# Altium schematic sheet Э3_7.SchDoc
size 420 x 297 mm; SheetNumber: 7; Scale: 1:1; DocumentType: Схема электрическая принципиальная
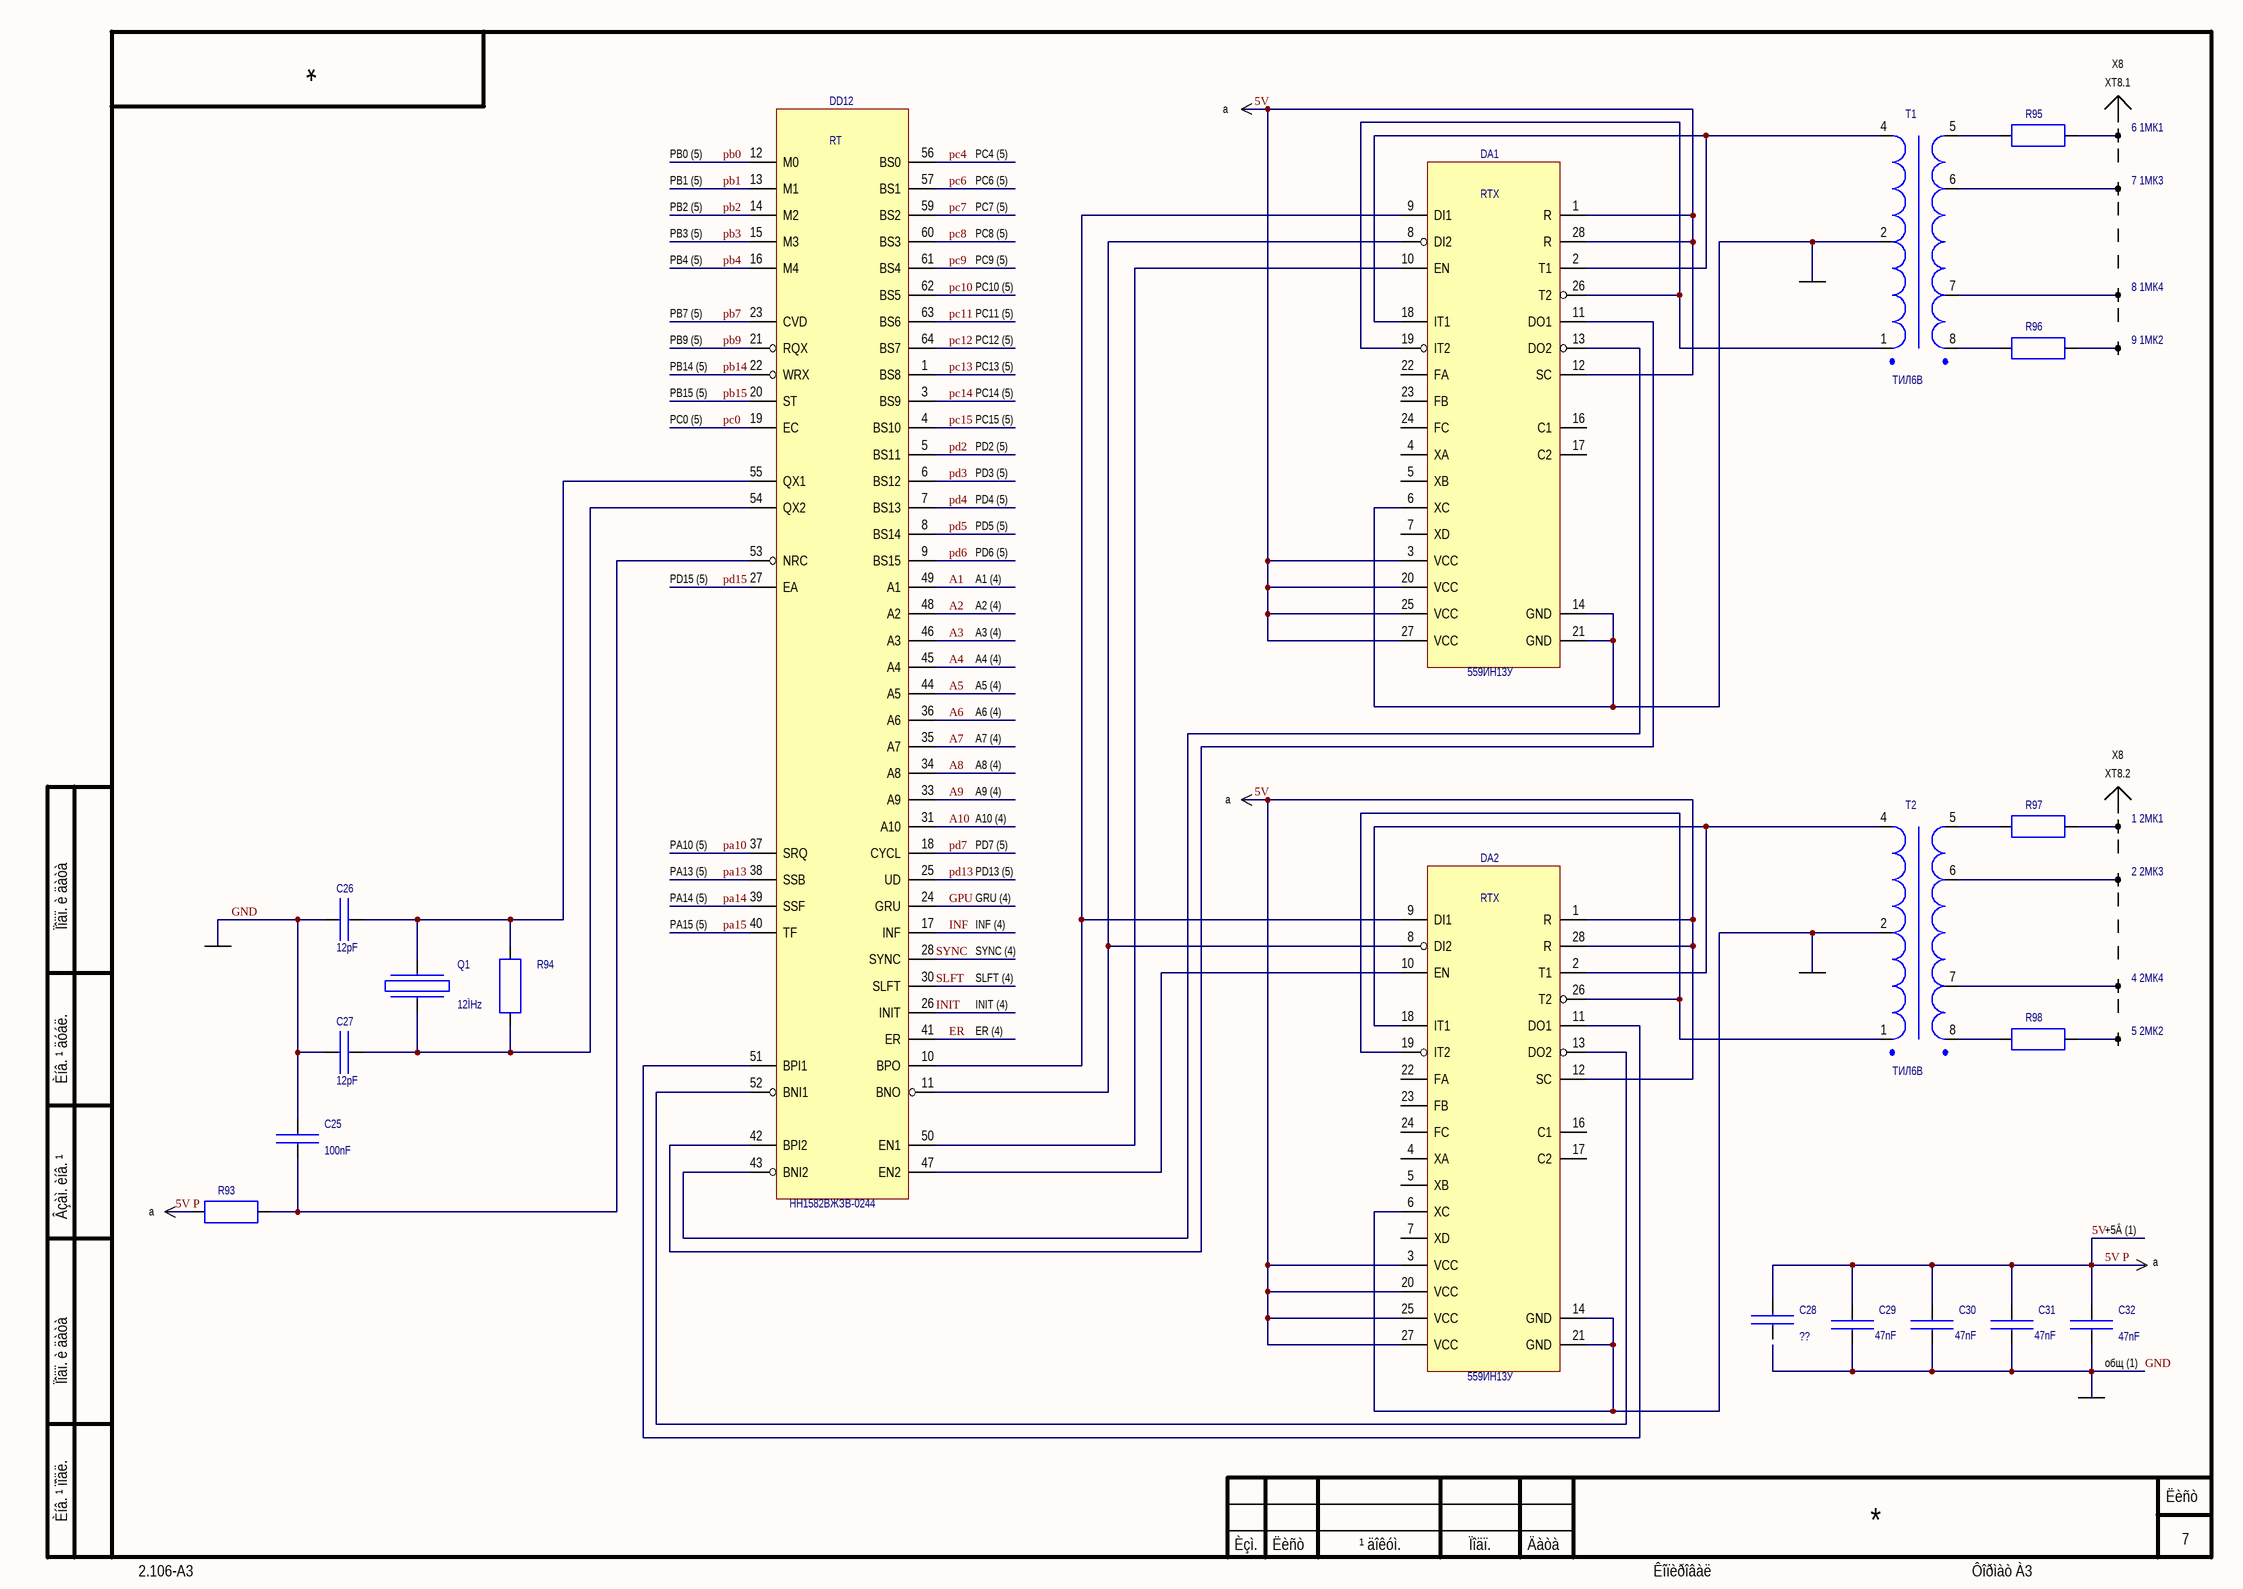
[diagram p0: Э3_7.SchDoc]

## Parts
C25  100nF  [CAP0805]
C26  12pF  [CAP0805]
C27  12pF  [CAP0805]
C28  ??  [CAP0805]
C29  47nF  [CAP0805]
C30  47nF  [CAP0805]
C31  47nF  [CAP0805]
C32  47nF  [CAP0805]
DA1  559ИН13У  [H09.28-1B]
DA2  559ИН13У  [H09.28-1B]
DD12  НН1582ВЖЗВ-0244  [H18.64-1B]
Q1  12ÌHz
R93  100k  [RES0805]  (value not drawn)
R94  240k  [RES0805]  (value not drawn)
R95  56  [RES0805]  (value not drawn)
R96  56  [RES0805]  (value not drawn)
R97  56  [RES0805]  (value not drawn)
R98  56  [RES0805]  (value not drawn)
T1  ТИЛ6B  [TIL6V]
T2  ТИЛ6B  [TIL6V]
X8  1 2МК1  [PLD10]  (parts A,B,D,E,F,G,H,I of 10)

## Nets
5V: C28.1 C29.2 C30.2 C31.2 C32.2 DA1.1(R) DA1.3(VCC) DA1.12(SC) DA1.20(VCC) DA1.25(VCC) DA1.27(VCC) DA1.28(R) DA2.1(R) DA2.3(VCC) DA2.12(SC) DA2.20(VCC) DA2.25(VCC) DA2.27(VCC) DA2.28(R) R93.1  [also labelled 5V P]
A1: DD12.49(A1)
A2: DD12.48(A2)
A3: DD12.46(A3)
A4: DD12.45(A4)
A5: DD12.44(A5)
A6: DD12.36(A6)
A7: DD12.35(A7)
A8: DD12.34(A8)
A9: DD12.33(A9)
A10: DD12.31(A10)
ER: DD12.41(ER)
GND: C25.2 C26.1 C27.1 C29.1 C30.1 C31.1 C32.1 DA2.6(XC) DA2.14(GND) DA2.21(GND) T2.2
GPU: DD12.24(GRU)
INF: DD12.17(INF)
INIT: DD12.26(INIT)
pa10: DD12.37(SRQ)
pa13: DD12.38(SSB)
pa14: DD12.39(SSF)
pa15: DD12.40(TF)
pb0: DD12.12(M0)
pb1: DD12.13(M1)
pb2: DD12.14(M2)
pb3: DD12.15(M3)
pb4: DD12.16(M4)
pb7: DD12.23(CVD)
pb9: DD12.21(RQX)
pb14: DD12.22(WRX)
pb15: DD12.20(ST)
pc0: DD12.19(EC)
pc4: DD12.56(BS0)
pc6: DD12.57(BS1)
pc7: DD12.59(BS2)
pc8: DD12.60(BS3)
pc9: DD12.61(BS4)
pc10: DD12.62(BS5)
pc11: DD12.63(BS6)
pc12: DD12.64(BS7)
pc13: DD12.1(BS8)
pc14: DD12.3(BS9)
pc15: DD12.4(BS10)
pd2: DD12.5(BS11)
pd3: DD12.6(BS12)
pd4: DD12.7(BS13)
pd5: DD12.8(BS14)
pd6: DD12.9(BS15)
pd7: DD12.18(CYCL)
pd13: DD12.25(UD)
pd15: DD12.27(EA)
SLFT: DD12.30(SLFT)
SYNC: DD12.28(SYNC)
NetC25_1: C25.1 DD12.53(NRC) R93.2
NetC26_2: C26.2 DD12.55(QX1) Q1.2 R94.2
NetC27_2: C27.2 DD12.54(QX2) Q1.1 R94.1
NetDA1_2: DA1.2(T1) DA1.18(IT1) T1.4
NetDA1_6: DA1.6(XC) DA1.14(GND) DA1.21(GND) T1.2
NetDA1_8: DA1.8(DI2) DA2.8(DI2) DD12.11(BNO)
NetDA1_9: DA1.9(DI1) DA2.9(DI1) DD12.10(BPO)
NetDA1_10: DA1.10(EN) DD12.50(EN1)
NetDA1_11: DA1.11(DO1) DD12.42(BPI2)
NetDA1_13: DA1.13(DO2) DD12.43(BNI2)
NetDA1_19: DA1.19(IT2) DA1.26(T2) T1.1
NetDA2_2: DA2.2(T1) DA2.18(IT1) T2.4
NetDA2_10: DA2.10(EN) DD12.47(EN2)
NetDA2_11: DA2.11(DO1) DD12.51(BPI1)
NetDA2_13: DA2.13(DO2) DD12.52(BNI1)
NetDA2_19: DA2.19(IT2) DA2.26(T2) T2.1
NetR95_1: R95.1 T1.5
NetR95_2: R95.2 X8.6
NetR96_1: R96.1 T1.8
NetR96_2: R96.2 X8.9
NetR97_1: R97.1 T2.5
NetR97_2: R97.2 X8.1
NetR98_1: R98.1 T2.8
NetR98_2: R98.2 X8.5
NetT1_6: T1.6 X8.7
NetT1_7: T1.7 X8.8
NetT2_6: T2.6 X8.2
NetT2_7: T2.7 X8.4

Not connected (* = marked no-connect by the designer): C28 2; DA1 4(XA) 5(XB) 7(XD) 16(C1) 17(C2) 22(FA) 23(FB) 24(FC); DA2 4(XA) 5(XB) 7(XD) 16(C1) 17(C2) 22(FA) 23(FB) 24(FC)

## Notes on the sheet
- X8
- a
- XT8.1
- PB1 (5)
- PB0 (5)
- PC4 (5)
- PC6 (5)
- PB2 (5)
- PB3 (5)
- PC7 (5)
- PC8 (5)
- PB7 (5)
- PB4 (5)
- PC9 (5)
- PC10 (5)
- PC11 (5)
- PB9 (5)
- PB14 (5)
- PB15 (5)
- PC12 (5)
- PC13 (5)
- PC14 (5)
- PC0 (5)
- PC15 (5)
- PD2 (5)
- PD3 (5)
- PD4 (5)
- PD5 (5)
- PD15 (5)
- A1 (4)
- PD6 (5)
- A2 (4)
- A3 (4)
- A4 (4)
- A5 (4)
- A6 (4)
- A7 (4)
- A8 (4)
- A9 (4)
- XT8.2
- PA10 (5)
- A10 (4)
- PD7 (5)
- PA13 (5)
- PA14 (5)
- PA15 (5)
- PD13 (5)
- GRU (4)
- INF (4)
- SYNC (4)
- SLFT (4)
- INIT (4)
- ER (4)
- (near R93) a
- +5Â (1)
- (near C32) общ (1)
- Ïîäï. è äàòà
- Èíâ. ¹ äóáë.
- Âçàì. èíâ. ¹
- Èíâ. ¹ ïîäë.
- Èçì.
- Ëèñò
- ¹ äîêóì.
- Ïîäï.
- Äàòà
- 2.106-A3
- Êîïèðîâàë
- Ôîðìàò À3
- (in symbol 559ИН13У) RTX
- (in symbol НН1582ВЖЗВ-0244) RT

## Library data of the parts
C25 C32 = C_2
C26-C31 = C
Q1 = Q_1
R93-R95 R97 R98 = R
R96 = R_1
X8 = PLD10